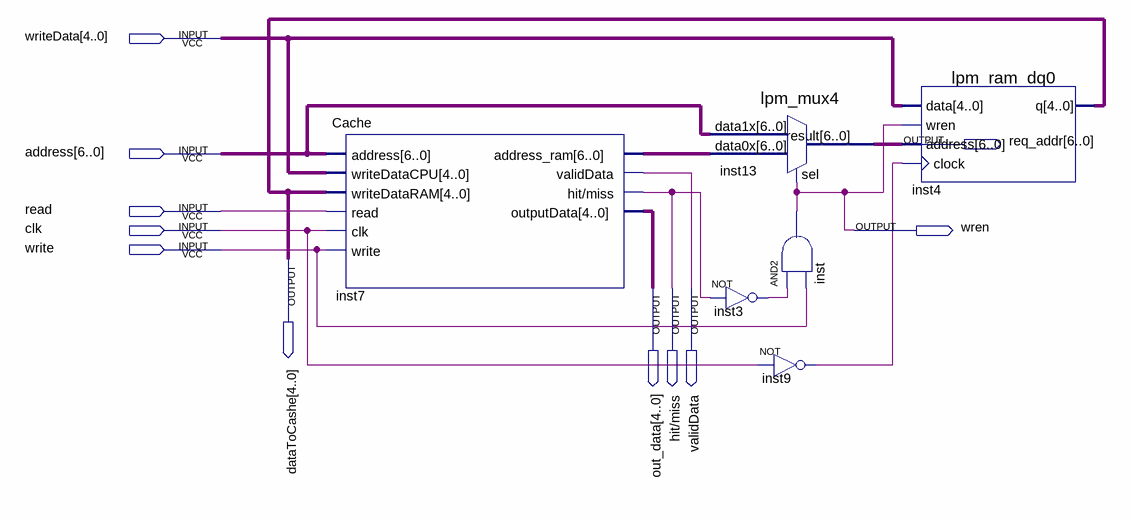
[diagram p0: schematic sheet]
// Quartus schematic Lab6.bdf as structural Verilog: 6 symbols, 11 pins
module Lab6 (
  input  [4:0] writeData,
  input  [6:0] address,
  input  read,
  input  clk,
  input  write,
  output [6:0] req_addr,
  output wren,
  output [4:0] dataToCashe,
  output [4:0] out_data,
  output \hit/miss ,
  output validData
);

  wire inst3_out, inst9_out;
  wire [6:0] inst7_address_ram;

  Cache inst7 (
    .address(address), .writeDataCPU(writeData), .writeDataRAM(dataToCashe), .read(read), .clk(clk),
    .write(write), .address_ram(inst7_address_ram), .validData(validData), .\hit/miss (\hit/miss ),
    .outputData(out_data));
  lpm_mux4 inst13 (.data1x(address), .data0x(inst7_address_ram), .sel(wren), .result(req_addr));
  not inst3 (inst3_out, \hit/miss );
  and inst (wren, inst3_out, write);
  not inst9 (inst9_out, clk);
  lpm_ram_dq0 inst4 (.data(writeData), .wren(wren), .address(req_addr), .clock(inst9_out), .q(dataToCashe));
endmodule
